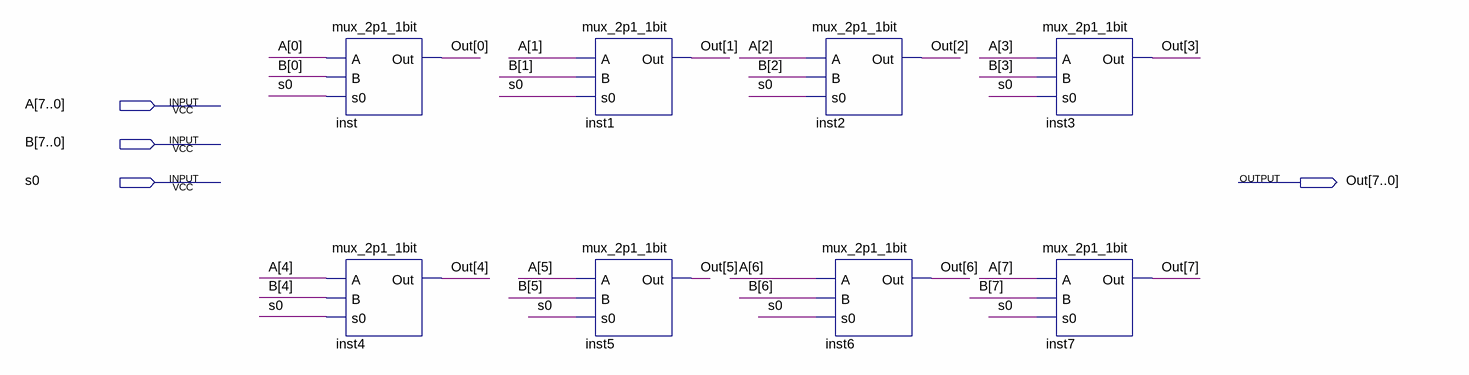
[diagram p0: schematic sheet]
// Quartus schematic Mux_2p1_8b.bdf as structural Verilog: 8 symbols, 4 pins
module Mux_2p1_8b (
  input  [7:0] A,
  input  [7:0] B,
  input  s0,
  output [7:0] Out
);

  mux_2p1_1bit inst (.A(A[0]), .B(B[0]), .s0(s0), .Out(Out[0]));
  mux_2p1_1bit inst4 (.A(A[4]), .B(B[4]), .s0(s0), .Out(Out[4]));
  mux_2p1_1bit inst1 (.A(A[1]), .B(B[1]), .s0(s0), .Out(Out[1]));
  mux_2p1_1bit inst5 (.A(A[5]), .B(B[5]), .s0(s0), .Out(Out[5]));
  mux_2p1_1bit inst2 (.A(A[2]), .B(B[2]), .s0(s0), .Out(Out[2]));
  mux_2p1_1bit inst6 (.A(A[6]), .B(B[6]), .s0(s0), .Out(Out[6]));
  mux_2p1_1bit inst3 (.A(A[3]), .B(B[3]), .s0(s0), .Out(Out[3]));
  mux_2p1_1bit inst7 (.A(A[7]), .B(B[7]), .s0(s0), .Out(Out[7]));
endmodule
